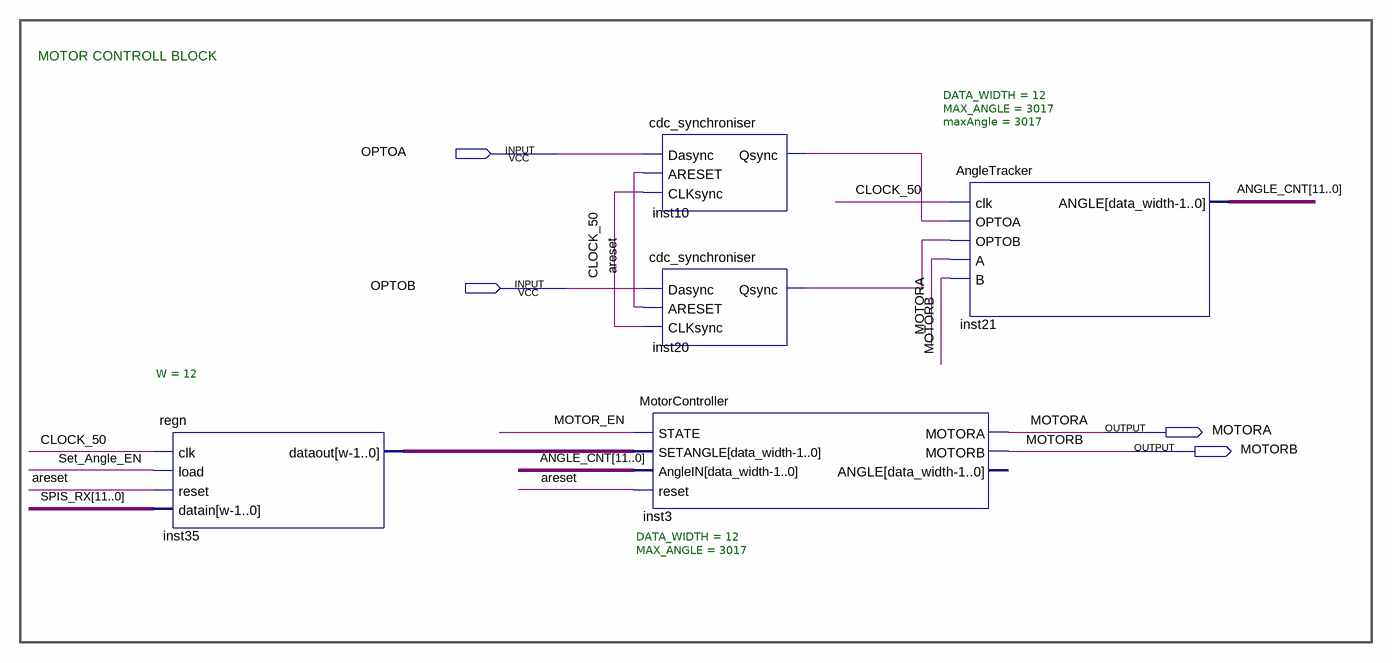
[diagram p0: schematic sheet]
// Quartus schematic MotorBlock.bdf as structural Verilog: 5 symbols, 4 pins
module MotorBlock (
  input  OPTOA,
  input  OPTOB,
  output MOTORA,
  output MOTORB
);

  wire areset, CLOCK_50, inst10_qsync, inst20_qsync, MOTOR_EN, Set_Angle_EN;
  wire [11:0] ANGLE_CNT, inst35_dataout, SPIS_RX;

  regn #(.W(12)) inst35 (
    .clk(CLOCK_50), .load(Set_Angle_EN), .reset(areset), .datain(SPIS_RX), .dataout(inst35_dataout));
  cdc_synchroniser inst10 (.Dasync(OPTOA), .ARESET(areset), .CLKsync(CLOCK_50), .Qsync(inst10_qsync));
  cdc_synchroniser inst20 (.Dasync(OPTOB), .ARESET(areset), .CLKsync(CLOCK_50), .Qsync(inst20_qsync));
  MotorController #(.DATA_WIDTH(12), .MAX_ANGLE(3017)) inst3 (
    .STATE(MOTOR_EN), .SETANGLE(inst35_dataout), .AngleIN(ANGLE_CNT), .reset(areset), .MOTORA(MOTORA),
    .MOTORB(MOTORB));  // open: ANGLE
  AngleTracker #(.DATA_WIDTH(12), .MAX_ANGLE(3017), .maxAngle(3017)) inst21 (
    .clk(CLOCK_50), .OPTOA(inst10_qsync), .OPTOB(inst20_qsync), .A(MOTORA), .B(MOTORB), .ANGLE(ANGLE_CNT));

  // Notes on the sheet:
  //   MOTOR CONTROLL BLOCK 
endmodule
